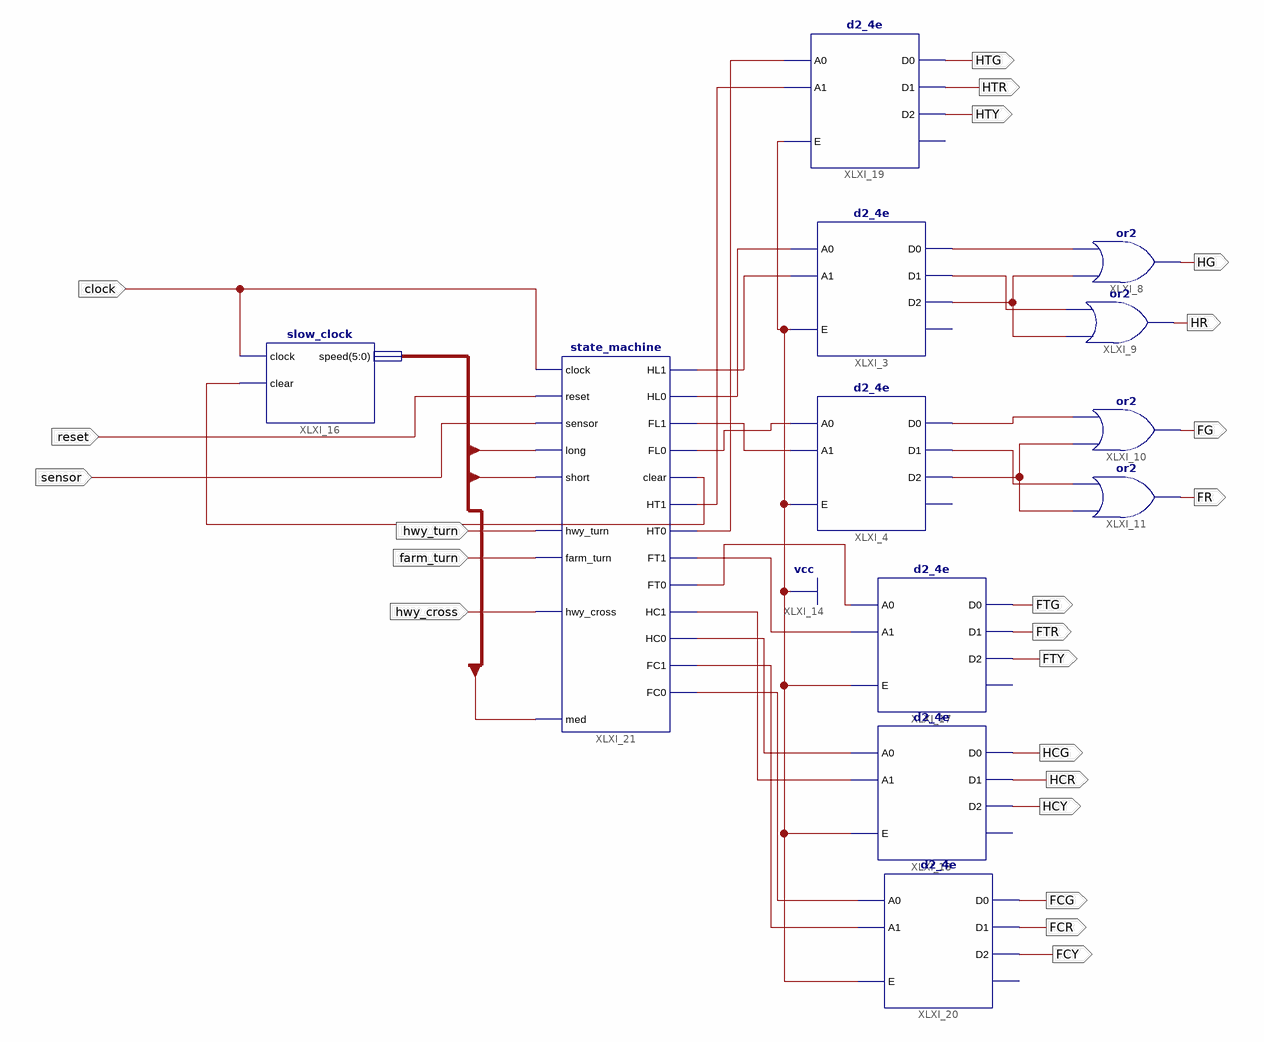
[diagram p0: schematic sheet 1]
// Xilinx ISE schematic top.sch (artix7) as structural Verilog: 12 symbols, 22 ports
module top (
  input  clock,
  input  reset,
  input  sensor,
  input  hwy_turn,
  input  farm_turn,
  input  hwy_cross,
  output FG,
  output FR,
  output HG,
  output HR,
  output HTG,
  output HTR,
  output HTY,
  output FTG,
  output FTR,
  output FTY,
  output HCG,
  output HCR,
  output HCY,
  output FCG,
  output FCR,
  output FCY
);

  wire XLXN_6, XLXN_13, XLXN_14, XLXN_15, XLXN_16, XLXN_18, XLXN_19, XLXN_20, XLXN_24, XLXN_25, XLXN_26,
       XLXN_42, XLXN_43, XLXN_44, XLXN_45, XLXN_46, XLXN_47, XLXN_48, XLXN_49;
  wire [5:0] speed;

  d2_4e XLXI_3 (.A0(XLXN_14), .A1(XLXN_13), .E(1'b1), .D0(XLXN_18), .D1(XLXN_20), .D2(XLXN_19));  // open: D3
  d2_4e XLXI_4 (.A0(XLXN_16), .A1(XLXN_15), .E(1'b1), .D0(XLXN_24), .D1(XLXN_25), .D2(XLXN_26));  // open: D3
  or XLXI_8 (HG, XLXN_19, XLXN_18);
  or XLXI_9 (HR, XLXN_19, XLXN_20);
  or XLXI_10 (FG, XLXN_26, XLXN_24);
  or XLXI_11 (FR, XLXN_26, XLXN_25);
  slow_clock XLXI_16 (.clock(clock), .clear(XLXN_6), .speed(speed));
  d2_4e XLXI_17 (.A0(XLXN_46), .A1(XLXN_47), .E(1'b1), .D0(FTG), .D1(FTR), .D2(FTY));  // open: D3
  d2_4e XLXI_18 (.A0(XLXN_44), .A1(XLXN_45), .E(1'b1), .D0(HCG), .D1(HCR), .D2(HCY));  // open: D3
  d2_4e XLXI_19 (.A0(XLXN_48), .A1(XLXN_49), .E(1'b1), .D0(HTG), .D1(HTR), .D2(HTY));  // open: D3
  d2_4e XLXI_20 (.A0(XLXN_42), .A1(XLXN_43), .E(1'b1), .D0(FCG), .D1(FCR), .D2(FCY));  // open: D3
  state_machine XLXI_21 (
    .clock(clock), .reset(reset), .sensor(sensor), .long(speed[5]), .med(speed[4]), .short(speed[3]),
    .hwy_turn(hwy_turn), .farm_turn(farm_turn), .hwy_cross(hwy_cross), .HL1(XLXN_13), .HL0(XLXN_14),
    .FL1(XLXN_15), .FL0(XLXN_16), .HT1(XLXN_49), .HT0(XLXN_48), .FT1(XLXN_47), .FT0(XLXN_46), .HC1(XLXN_45),
    .HC0(XLXN_44), .FC1(XLXN_43), .FC0(XLXN_42), .clear(XLXN_6));
endmodule
